# EAGLE design SHO (EAGLE 7.1.0)
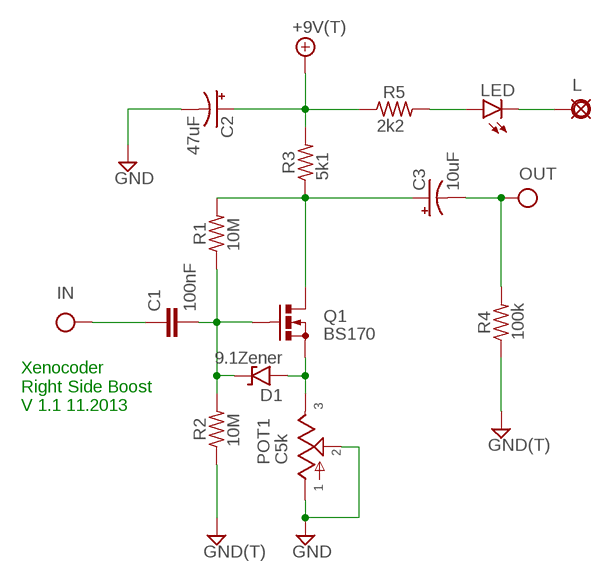
[diagram p0: schematic, sheet 1]

## Parts
+9V  +9V(T)  [SQUARE]
C1  100nF  075X0302  [075X030]
C2  47uF  0631  [063_025]
C3  10uF  0631  [063_025]
D1  9.1Zener  1N9ZENER  [DO35-3]
G  GND(T)  [SQUARE]
GND  GND(T)  [SQUARE]
IN  IN(T)  [SQUARE]
L  3mm  PAD  [SQUARE]
LED  LED3MM  [LED3MM]
OUT  OUT(T)  [SQUARE]
POT1  C5k  POT16MM_PCB_PADS  [16MM_PCB_PADS]
Q1  BS170  [SOT54ES]
R1  10M  6MM.3  [R0207/3]
R2  10M  6MM.3  [R0207/3]
R3  5k1  6MM.3  [R0207/3]
R4  100k  6MM.3  [R0207/3]
R5  2k2  6MM.3  [R0207/3]

## Nets
+9V: +9V.1(+9V) C2.+ R3.2 R5.1
GND: C2.- G.1(GND) GND.1(GND) POT1.1 POT1.2 R2.1 R4.1
IN: C1.1 IN.1(IN)
N$1: C3.+ Q1.D R1.2 R3.1
N$2: D1.A POT1.3 Q1.S
N$3: C1.2 D1.C Q1.G R1.1 R2.2
N$4: LED.A R5.2
N$5: L.1(PAD) LED.K(C)
OUT: C3.- OUT.1(OUT) R4.2

## Notes on the sheet
- Xenocoder
  Right Side Boost
  V 1.1 11.2013

## Library data of the parts
+9V = mb_supply:+9V(T): +9V Voltage Supply use this to hook up +9v throughout a schematic instead of running wire automatically labels the net "+9v" adds a hookup pad to the circuit board
C1 = mb_caps-chicklet:075X030: 0.015 - 0.022uF Panasonic ECQ-B 7.5mm x 3mm 50 or 63V: 0.015 - 0.022uF;
C2 C3 = mb_caps-electro:063: 33 - 220uF Xicon values at Mouser.com 10V: 220uF; 16V: 100uF; 25V: 100uF; 50V: 33uF
D1 = mb_diodes:1N9*ZENER: 1N9???B Zener Diode DO-35 case 1N957B - 1N992B (6.8V to 200V)
G GND = mb_supply:GND(T): Ground use this to hook up ground (GND) throughout a schematic instead of running wire automatically labels the net "GND" adds a hookup pad to the circuit board (you can use several)
IN = mb_supply:IN(T): Input obsolete: use Pad instead and label net shematic input label with circuit board terminal/pad generally used only once on a schematic (because this device labels the net "IN" in the same way as a voltage supply or ground net)
L = mb_supply:PAD: PAD use this package for pads with any purpose, including input, output, send or return various pad shapes: round, square, octogonal, long, and long offset
LED = mb_diodes:LED
OUT = mb_supply:OUT(T): Output obsolete: use Pad instead and label net output label with circuit board terminal/pad usually appears only once on a schematic
POT1 = mb_pots:POT: Potentiometers the arrow indicates the clockwise motion of th wiper (lug 2) fully counter clockwise there is no resistance between lugs 1 and 2 fully clockwise the resistance between lugs 1 and 2 is the value of the pot
Q1 = mb_trans:BS170: N-CHANNEL MOS FET
R1-R5 = mb_resistors:6MM: 6mm Resistors Leads spaced 1-6 holes apart for 0.1" perfboard. Suitable for 1/4 watt resistors.

## Board
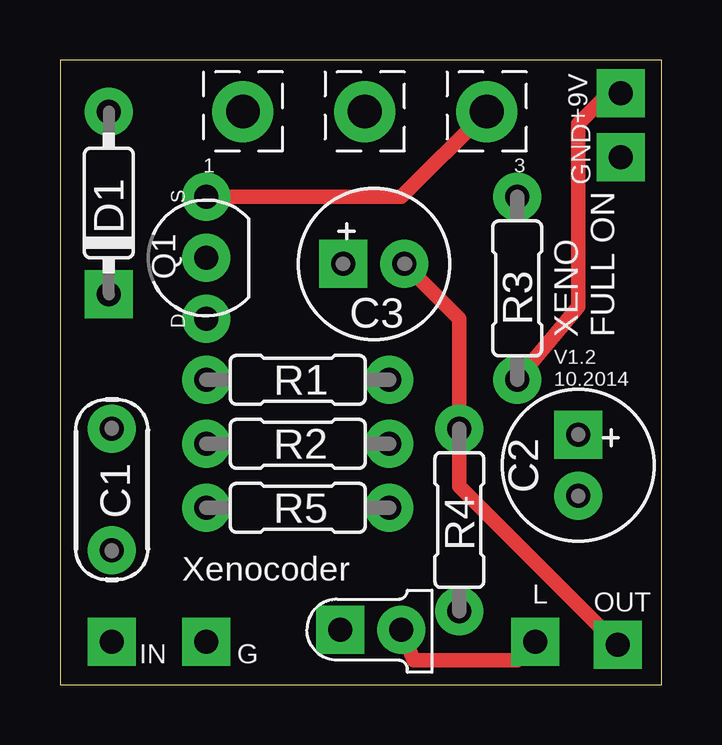
[diagram p1: board, top side]
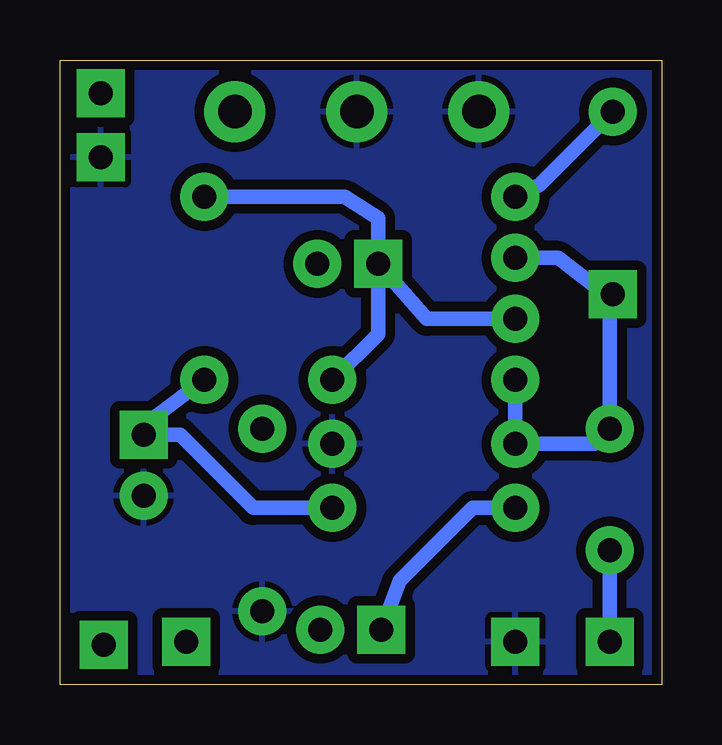
[diagram p2: board, bottom side, seen from below]

Size 25.07 x 26.02 mm. Coordinates in mm from the lower left corner, seen from the top.
Outline: 0,0 25.07,0 25.07,26.02 0,26.02 0,0
Copper layers (1*16): Top 0.0356mm / dielectric 1.5011mm / Bottom 0.0356mm
Design rules "LaenPCBOrder": minimum track width 6mil, minimum drill 13mil, track to track 6mil, track to pad 6mil, pad to pad 6mil, via to via 6mil, smd to smd 6mil, copper to edge 15mil, drill to drill 6mil, minimum pad ring 7mil, minimum via ring 7mil, stop-mask expansion 3mil, vias tented up to drill 0mil, thermal gap 10mil

### Footprints (pad centres in the part's own frame; a part is rotated, then mirrored left to right if it is on the bottom)
SQUARE = drill 1 pad 2 square: 1 0,0
075X030 = drill 1 pad 2: 1 -2.54,0; 2 2.54,0
063_025 = drill 1 pad 2 square: + -1.27,0 | drill 1 pad 2: - 1.27,0
DO35-3 = drill 1 pad 2: A 3.81,0 | drill 1 pad 2 square: C -3.81,0
LED3MM = drill 1 pad 2 square: A -1.27,0 | drill 1 pad 2: K 1.27,0
16MM_PCB_PADS = drill 1.4 pad 2.54: 1 5.08,0; 2 0,0; 3 -5.08,0
SOT54ES = drill 1 pad 2: D -2.54,0; G 0,0; S 2.54,0
R0207/3 = drill 1 pad 2: 1 -3.81,0; 2 3.81,0

### Placement (x,y rotation side)
+9V  23.37,24.64 0 top
C1  2.16,8.13 90 top
C2  21.59,9.14 270 top
C3  13.08,17.53 0 top
D1  2.03,20.07 90 top
G  6.1,1.78 0 top
GND  23.37,21.97 0 top
IN  2.16,1.78 0 top
L  19.81,1.78 0 top
LED  12.95,2.29 0 top
OUT  23.24,1.65 0 top
POT1  12.7,23.88 180 top
Q1  6.1,17.78 90 top
R1  9.91,12.7 0 top
R2  9.91,10.03 180 top
R3  19.05,16.51 270 top
R4  16.64,6.86 90 top
R5  9.91,7.37 180 top

### Tracks (layer width: path | path; a pad name or v marks a point on that pad's centre or on a via)
+9V
  Top 0.61: R3.2 21.59,15.75 21.59,23.37 22.86,24.64 +9V.1
  Bottom 0.61: R5.1 17.02,7.37 20.07,10.41 21.08,10.41 | 21.08,10.41 C2.+ | R3.2 21.08,11.18 21.08,10.41
GND
  pour Bottom (isolate 0.406): 0.25,25.65 24.89,25.65 24.89,0.25 0.25,0.25
IN
  Bottom 0.61: IN.1 C1.1
N$1
  Bottom 0.61: Q1.D 9.78,15.24 C3.+ | C3.+ 11.81,19.43 13.21,20.32 R3.1 | R1.2 11.81,14.61 C3.+
N$2
  Top 0.61: Q1.S 14.22,20.32 POT1.3
  Bottom 0.61: D1.A 5.08,20.83 Q1.S
N$3
  Bottom 0.61: D1.C 2.16,16.13 | 2.16,16.13 C1.2 2.79,10.03 R2.2 R1.1 | 2.16,16.13 4.32,17.78 Q1.G
N$4
  Bottom 0.61: LED.A 10.92,4.32 7.87,7.37 R5.2
N$5
  Top 0.61: LED.K 14.73,1.02 19.05,1.02 L.1
OUT
  Top 0.61: OUT.1 16.64,8.26 R4.2 16.64,15.24 C3.-

### Text on the board
tPlace: XENO / FULL ON | V1.2 / 10.2014 | Xenocoder